# Altium schematic sheet communication.SchDoc
size A4
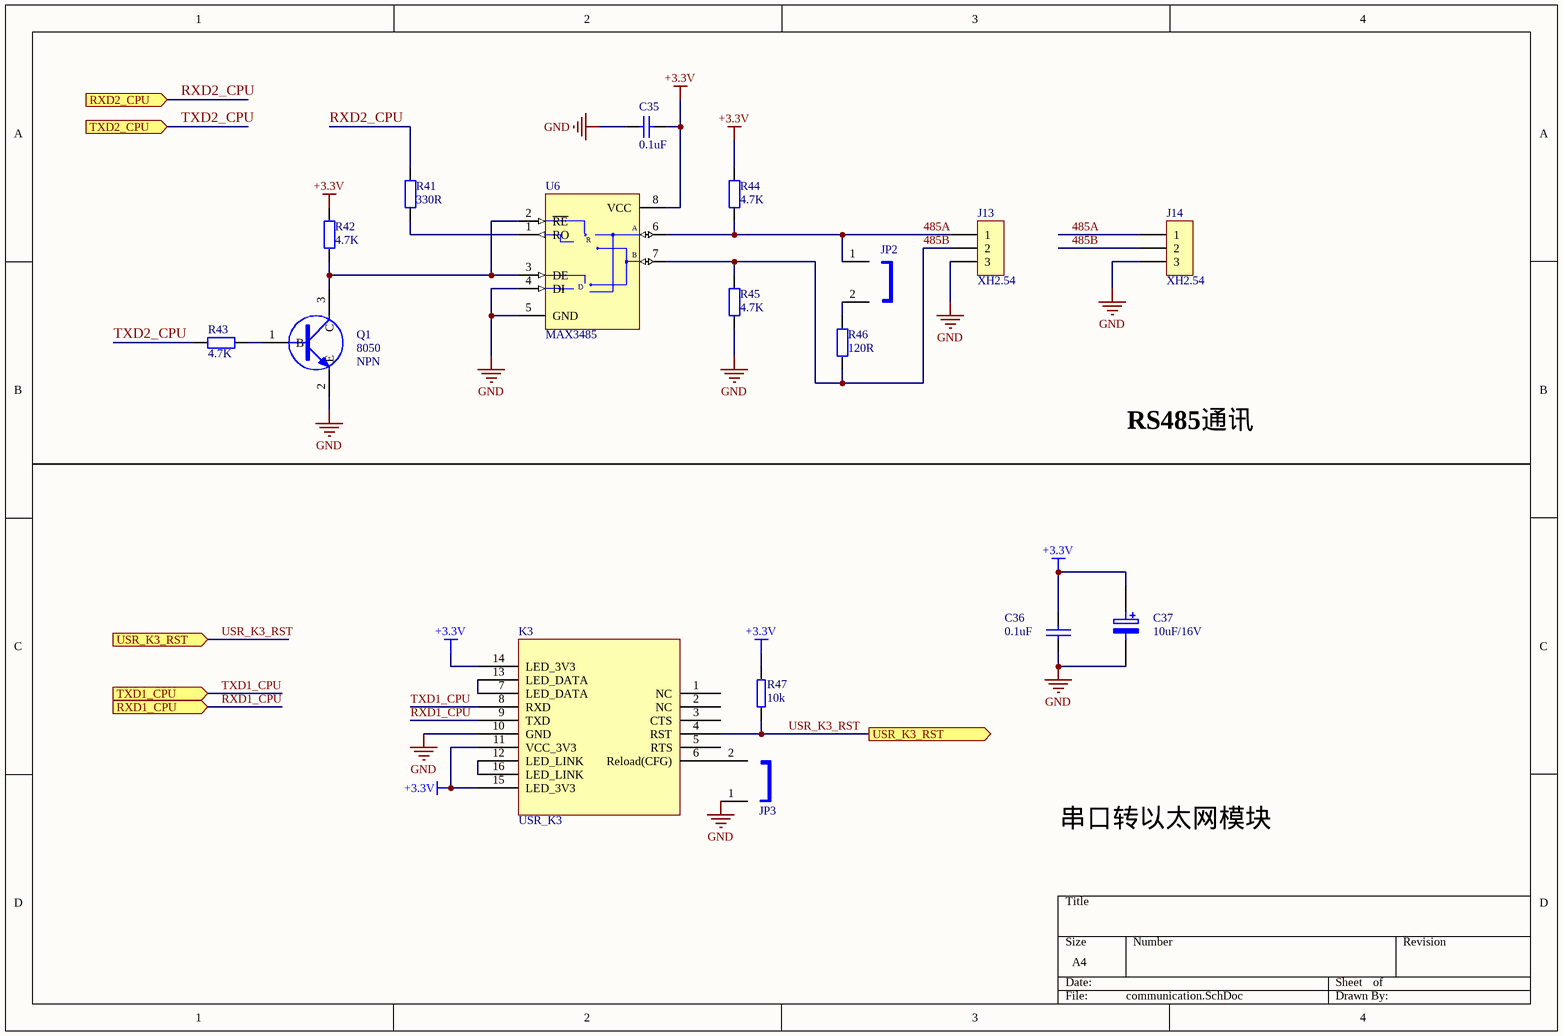
[diagram p0: communication.SchDoc]

## Parts
C35  0.1uF  [0805_CAP]
C36  0.1uF  [0805_CAP]
C37  10uF/16V  [CASE-A_3216]
J13  XH2.54  [XH2,.54-3P]
J14  XH2.54  [XH2,.54-3P]
JP2  JUMPER  [SIP2]  (value not drawn)
JP3  JUMPER  [SIP2]  (value not drawn)
K3  USR_K3  [USR-K3]
Q1  8050  [SOT-23]
R41  330R  [0805_RES]
R42  4.7K  [0805_RES]
R43  4.7K  [0805_RES]
R44  4.7K  [0805_RES]
R45  4.7K  [0805_RES]
R46  120R  [0805_RES]
R47  10k  [0805_RES]
U6  MAX3485  [SOIC-8_150mil]

## Ports
RXD1_CPU, RXD2_CPU (in), TXD1_CPU, TXD2_CPU (in), USR_K3_RST, USR_K3_RST (out)

## Nets
+3.3V: C35.2 C36.1 C37.1 K3.11(VCC_3V3) K3.14(LED_3V3) K3.15(LED_3V3) R42.2 R44.2 R47.2 U6.8(VCC)
GND: C35.1 C36.2 C37.2 J13.3 J14.3 JP3.1 K3.10(GND) Q1.2(E) R45.1 U6.4(DI) U6.5(GND)
485A: J13.1 J14.1 JP2.1 R44.1 U6.6(A)
485B: J13.2 J14.2 R45.2 R46.1 U6.7(B)
RXD1_CPU: K3.9(TXD) ; port RXD1_CPU
RXD2_CPU: R41.2 ; port RXD2_CPU
TXD1_CPU: K3.8(RXD) ; port TXD1_CPU
TXD2_CPU: R43.1 ; port TXD2_CPU
USR_K3_RST: K3.4(RST) R47.1 ; port USR_K3_RST
NetJP2_2: JP2.2 R46.2
NetJP3_2: JP3.2 K3.6(Reload(CFG))
NetK3_7: K3.7(LED_DATA) K3.13(LED_DATA)
NetK3_12: K3.12(LED_LINK) K3.16(LED_LINK)
NetQ1_1: Q1.1(B) R43.2
NetQ1_3: Q1.3(C) R42.1 U6.2(~{RE}) U6.3(DE)
NetR41_1: R41.1 U6.1(RO)

Not connected (* = marked no-connect by the designer): K3 1(NC) 2(NC) 3(CTS) 5(RTS)

## Notes on the sheet
- (near Q1) NPN
- RS485通讯
- 串口转以太网模块
- (in symbol MAX485) R; D

## Library data of the parts
C35 = Cap: Capacitor; Published: 8-Jun-2000; LatestRevisionDate: 17-Jul-2002; LatestRevisionNote: Re-released for DXP Platform.; PackageReference: RAD-0.3; Publisher: Altium Limited; Value: 0.1uF
C36 = CAP: Capacitor
C37 = ELECTRO2: Electrolytic Capacitor
J13 J14 = CON3: Connector
K3 = USR-K
Q1 = 3NPN_SO_1
R41-R45 = Res2: Resistor; Published: 8-Jun-2000; LatestRevisionDate: 17-Jul-2002; LatestRevisionNote: Re-released for DXP Platform.; PackageReference: AXIAL-0.4; Publisher: Altium Limited
  R41: Value: 330R
  R42-R45: Value: 4.7K
R46 = Res2: Resistor; Value: 120; Published: 8-Jun-2000; LatestRevisionDate: 17-Jul-2002; LatestRevisionNote: Re-released for DXP Platform.; PackageReference: AXIAL-0.4; Publisher: Altium Limited
R47 = RES
U6 = MAX485